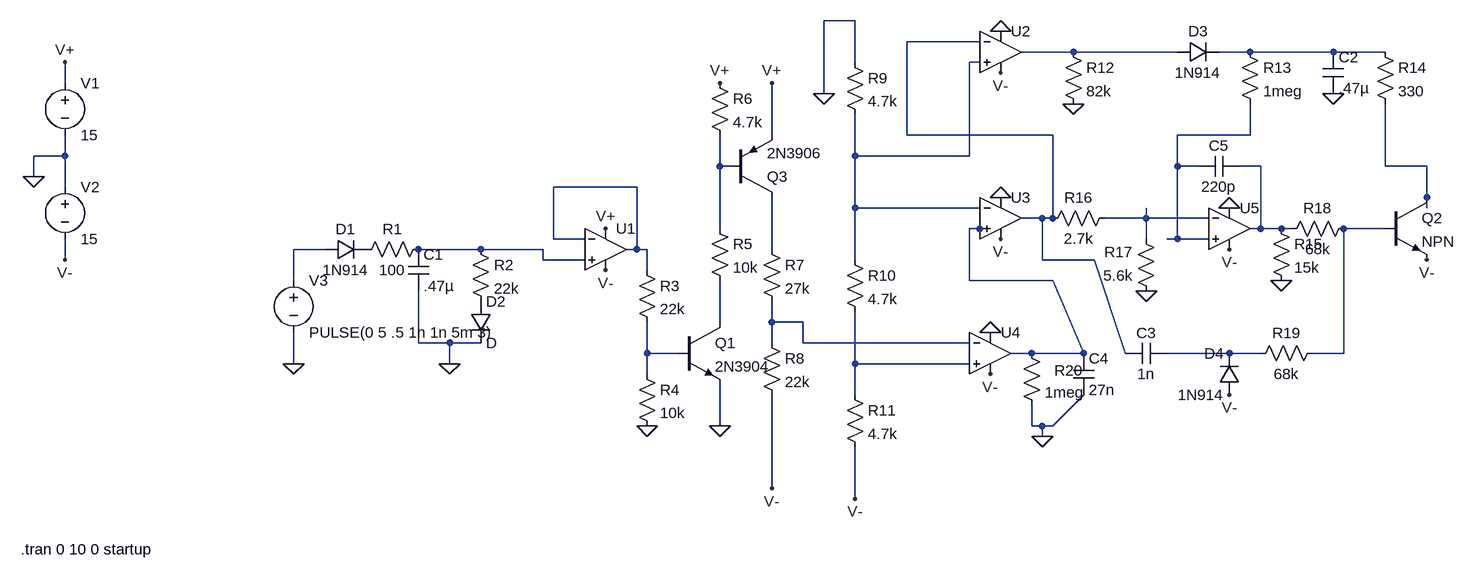
[diagram p0: schematic clap-amdek.asc]
clap-amdek.asc, the LTspice schematic file:
Version 4
SHEET 1 1848 680
WIRE 656 -160 608 -160
WIRE 848 -128 736 -128
WIRE 992 -112 912 -112
WIRE 1152 -112 992 -112
WIRE 1264 -112 1216 -112
WIRE 1392 -112 1264 -112
WIRE 1472 -112 1392 -112
WIRE 656 -96 656 -160
WIRE 848 -96 832 -96
WIRE -560 -64 -560 -96
WIRE 608 -48 608 -160
WIRE 528 16 528 -64
WIRE 736 16 736 -128
WIRE 960 16 736 16
WIRE 1264 16 1264 -32
WIRE 1264 16 1152 16
WIRE -560 48 -560 16
WIRE -560 48 -608 48
WIRE 656 48 656 -16
WIRE 832 48 832 -96
WIRE 832 48 656 48
WIRE 448 64 448 16
WIRE 464 64 448 64
WIRE 1152 64 1152 16
WIRE 1184 64 1152 64
WIRE 1280 64 1248 64
WIRE 1472 64 1472 -32
WIRE 1536 64 1472 64
WIRE -608 80 -608 48
WIRE -560 96 -560 48
WIRE 320 96 192 96
WIRE 1536 112 1536 64
WIRE 656 128 656 48
WIRE 848 128 656 128
WIRE 1536 128 1536 112
WIRE 944 144 912 144
WIRE 960 144 960 16
WIRE 960 144 944 144
WIRE 1104 144 1104 128
WIRE 1104 144 1040 144
WIRE 1200 144 1104 144
WIRE 448 160 448 64
WIRE 848 160 832 160
WIRE 864 160 848 160
WIRE 1280 160 1280 64
WIRE 1280 160 1264 160
WIRE 1312 160 1280 160
WIRE 1328 160 1312 160
WIRE 1472 160 1408 160
WIRE 192 176 192 96
WIRE 240 176 192 176
WIRE 1104 176 1104 144
WIRE 1152 176 1152 64
WIRE 1152 176 1136 176
WIRE 1200 176 1152 176
WIRE -160 192 -208 192
WIRE 80 192 -16 192
WIRE 176 192 80 192
WIRE 320 192 320 96
WIRE 320 192 304 192
WIRE 336 192 320 192
WIRE 528 192 528 112
WIRE -560 208 -560 176
WIRE 176 208 176 192
WIRE 240 208 176 208
WIRE 656 208 656 128
WIRE 944 208 944 144
WIRE 1024 208 944 208
WIRE 336 224 336 192
WIRE -208 240 -208 192
WIRE 832 240 832 160
WIRE 960 240 832 240
WIRE 448 304 448 240
WIRE 528 304 528 272
WIRE 576 304 528 304
WIRE -16 336 -16 256
WIRE 32 336 -16 336
WIRE 80 336 32 336
WIRE 528 336 528 304
WIRE 576 336 576 304
WIRE 832 336 576 336
WIRE 336 352 336 304
WIRE 384 352 336 352
WIRE 928 352 896 352
WIRE 1008 352 960 240
WIRE 1008 352 928 352
WIRE 1072 352 1024 208
WIRE 1232 352 1136 352
WIRE 1280 352 1232 352
WIRE 1408 352 1408 160
WIRE 1408 352 1360 352
WIRE -208 368 -208 320
WIRE 32 368 32 336
WIRE 656 368 656 288
WIRE 832 368 656 368
WIRE 336 384 336 352
WIRE 656 416 656 368
WIRE 448 464 448 400
WIRE 928 464 928 432
WIRE 944 464 928 464
WIRE 960 464 1008 416
WIRE 960 464 944 464
WIRE 944 480 944 464
WIRE 528 560 528 416
WIRE 656 576 656 496
FLAG -608 80 0
FLAG -208 368 0
FLAG -560 -96 V+
FLAG 272 160 V+
FLAG -560 208 V-
FLAG 272 224 V-
FLAG 880 176 V-
FLAG 880 -80 V-
FLAG 864 384 V-
FLAG 1232 192 V-
FLAG 1536 208 V-
FLAG 528 560 V-
FLAG 32 368 0
FLAG 336 464 0
FLAG 448 464 0
FLAG 448 -64 V+
FLAG 528 -64 V+
FLAG 608 -48 0
FLAG 656 576 V-
FLAG 1104 256 0
FLAG 992 -32 0
FLAG 1392 -48 0
FLAG 1312 240 0
FLAG 1232 416 V-
FLAG 944 480 0
FLAG 880 -144 0
FLAG 880 112 0
FLAG 864 320 0
FLAG 1232 128 0
SYMBOL Opamps\\UniversalOpamp2 272 192 R0
SYMATTR InstName U1
SYMBOL Opamps\\UniversalOpamp2 880 -112 R0
SYMATTR InstName U2
SYMBOL Opamps\\UniversalOpamp2 880 144 R0
SYMATTR InstName U3
SYMBOL Opamps\\UniversalOpamp2 864 352 R0
SYMATTR InstName U4
SYMBOL Opamps\\UniversalOpamp2 1232 160 R0
SYMATTR InstName U5
SYMBOL npn 384 304 R0
SYMATTR InstName Q1
SYMATTR Value 2N3904
SYMBOL npn 1472 112 R0
SYMATTR InstName Q2
SYMBOL pnp 464 112 M180
SYMATTR InstName Q3
SYMATTR Value 2N3906
SYMBOL voltage -560 -80 R0
WINDOW 123 0 0 Left 2
WINDOW 39 0 0 Left 2
SYMATTR InstName V1
SYMATTR Value 15
SYMBOL voltage -560 80 R0
WINDOW 123 0 0 Left 2
WINDOW 39 0 0 Left 2
SYMATTR InstName V2
SYMATTR Value 15
SYMBOL voltage -208 224 R0
WINDOW 123 0 0 Left 2
WINDOW 39 0 0 Left 2
SYMATTR InstName V3
SYMATTR Value PULSE(0 5 .5 1n 1n 5m 3)
SYMBOL diode -160 208 R270
WINDOW 0 32 32 VTop 2
WINDOW 3 0 32 VBottom 2
SYMATTR InstName D1
SYMATTR Value 1N914
SYMBOL res 0 176 R90
WINDOW 0 0 56 VBottom 2
WINDOW 3 32 56 VTop 2
SYMATTR InstName R1
SYMATTR Value 100
SYMBOL cap -32 192 R0
SYMATTR InstName C1
SYMATTR Value .47µ
SYMBOL diode 64 272 R0
SYMATTR InstName D2
SYMBOL res 64 176 R0
SYMATTR InstName R2
SYMATTR Value 22k
SYMBOL res 320 208 R0
SYMATTR InstName R3
SYMATTR Value 22k
SYMBOL res 320 368 R0
SYMATTR InstName R4
SYMATTR Value 10k
SYMBOL res 432 144 R0
SYMATTR InstName R5
SYMATTR Value 10k
SYMBOL res 432 -80 R0
SYMATTR InstName R6
SYMATTR Value 4.7k
SYMBOL res 512 176 R0
SYMATTR InstName R7
SYMATTR Value 27k
SYMBOL res 512 320 R0
SYMATTR InstName R8
SYMATTR Value 22k
SYMBOL res 640 -112 R0
SYMATTR InstName R9
SYMATTR Value 4.7k
SYMBOL res 640 192 R0
SYMATTR InstName R10
SYMATTR Value 4.7k
SYMBOL res 640 400 R0
SYMATTR InstName R11
SYMATTR Value 4.7k
SYMBOL res 976 -128 R0
SYMATTR InstName R12
SYMATTR Value 82k
SYMBOL diode 1152 -96 R270
WINDOW 0 32 32 VTop 2
WINDOW 3 0 32 VBottom 2
SYMATTR InstName D3
SYMATTR Value 1N914
SYMBOL res 1248 -128 R0
SYMATTR InstName R13
SYMATTR Value 1meg
SYMBOL cap 1376 -112 R0
SYMATTR InstName C2
SYMATTR Value .47µ
SYMBOL res 1456 -128 R0
SYMATTR InstName R14
SYMATTR Value 330
SYMBOL res 1296 144 R0
SYMATTR InstName R15
SYMATTR Value 15k
SYMBOL res 1056 128 R90
WINDOW 0 0 56 VBottom 2
WINDOW 3 32 56 VTop 2
SYMATTR InstName R16
SYMATTR Value 2.7k
SYMBOL res 1120 272 R180
WINDOW 0 36 76 Left 2
WINDOW 3 36 40 Left 2
SYMATTR InstName R17
SYMATTR Value 5.6k
SYMBOL res 1312 176 R270
WINDOW 0 32 56 VTop 2
WINDOW 3 0 56 VBottom 2
SYMATTR InstName R18
SYMATTR Value 68k
SYMBOL res 1264 368 R270
WINDOW 0 32 56 VTop 2
WINDOW 3 0 56 VBottom 2
SYMATTR InstName R19
SYMATTR Value 68k
SYMBOL diode 1248 416 R180
WINDOW 0 24 64 Left 2
WINDOW 3 24 0 Left 2
SYMATTR InstName D4
SYMATTR Value 1N914
SYMBOL cap 1136 336 R90
WINDOW 0 0 32 VBottom 2
WINDOW 3 32 32 VTop 2
SYMATTR InstName C3
SYMATTR Value 1n
SYMBOL res 912 336 R0
WINDOW 0 51 42 Left 2
SYMATTR InstName R20
SYMATTR Value 1meg
SYMBOL cap 992 352 R0
SYMATTR InstName C4
SYMATTR Value 27n
SYMBOL cap 1248 48 R90
WINDOW 0 0 32 VBottom 2
WINDOW 3 32 32 VTop 2
SYMATTR InstName C5
SYMATTR Value 220p
TEXT -628 654 Left 2 !.tran 0 10 0 startup

The netlist it stands for:
* clap-amdek.asc
XU1 N014 N009 V+ V- N009 level.2 Avol=1Meg GBW=10Meg Slew=10Meg ilimit=25m rail=0 Vos=0 phimargin=45 en=0 enk=0 in=0 ink=0 Rin=500Meg  ; pins IN+ IN- V+ V- OUT
XU2 N004 N001 0 V- N002 level.2 Avol=1Meg GBW=10Meg Slew=10Meg ilimit=25m rail=0 Vos=0 phimargin=45 en=0 enk=0 in=0 ink=0 Rin=500Meg  ; pins IN+ IN- V+ V- OUT
XU3 N011 N004 0 V- N001 level.2 Avol=1Meg GBW=10Meg Slew=10Meg ilimit=25m rail=0 Vos=0 phimargin=45 en=0 enk=0 in=0 ink=0 Rin=500Meg  ; pins IN+ IN- V+ V- OUT
XU4 N020 N017 0 V- N011 level.2 Avol=1Meg GBW=10Meg Slew=10Meg ilimit=25m rail=0 Vos=0 phimargin=45 en=0 enk=0 in=0 ink=0 Rin=500Meg  ; pins IN+ IN- V+ V- OUT
XU5 N005 N010 0 V- N007 level.2 Avol=1Meg GBW=10Meg Slew=10Meg ilimit=25m rail=0 Vos=0 phimargin=45 en=0 enk=0 in=0 ink=0 Rin=500Meg  ; pins IN+ IN- V+ V- OUT
Q1 N016 N018 0 0 2N3904
Q2 N008 N012 V- 0 NPN
Q3 N015 N006 V+ 0 2N3906
V1 V+ 0 15
V2 0 V- 15
V3 N013 0 PULSE(0 5 .5 1n 1n 5m 3)
D1 N013 P001 1N914
R1 N014 P001 100
C1 N014 0 .47µ
D2 P002 0 D
R2 N014 P002 22k
R3 N009 N018 22k
R4 N018 0 10k
R5 N006 N016 10k
R6 V+ N006 4.7k
R7 N015 N017 27k
R8 N017 V- 22k
R9 0 N004 4.7k
R10 N004 N020 4.7k
R11 N020 V- 4.7k
R12 N002 0 82k
D3 N002 N003 1N914
R13 N003 N005 1meg
C2 N003 0 .47µ
R14 N003 N008 330
R15 N007 0 15k
R16 N010 N001 2.7k
R17 0 N010 5.6k
R18 N007 N012 68k
R19 N019 N012 68k
D4 V- N019 1N914
C3 N019 N001 1n
R20 N011 0 1meg
C4 N011 0 27n
C5 N007 N005 220p
.model D D
.lib standard.dio
.model NPN NPN
.model PNP PNP
.lib standard.bjt
.tran 0 10 0 startup
.lib UniversalOpamps2.sub
.backanno
.end